# Altium schematic sheet FLS Start_A Distribution.SchDoc
size 558 x 401 mm; Organization: Carnegie Institution of Washington; SheetNumber: 0; SheetTotal: 0; PageSetup: Record=PageOptions|CenterHorizontal=True|CenterVertical=True|PrintScale=0.47|XCorrection=1.00|YCorrection=1.00|PrintKind=0|BorderSize=5000000|LeftOffset=0|BottomOffset=0|Orientation=2|PaperLength=1000|PaperWidth=1000|Scale=100|PaperSource=259|PrintQuality=600|MediaType=1|DitherType=10|PaperKind=Letter (8.5 x 11")|PrintScaleMode=1
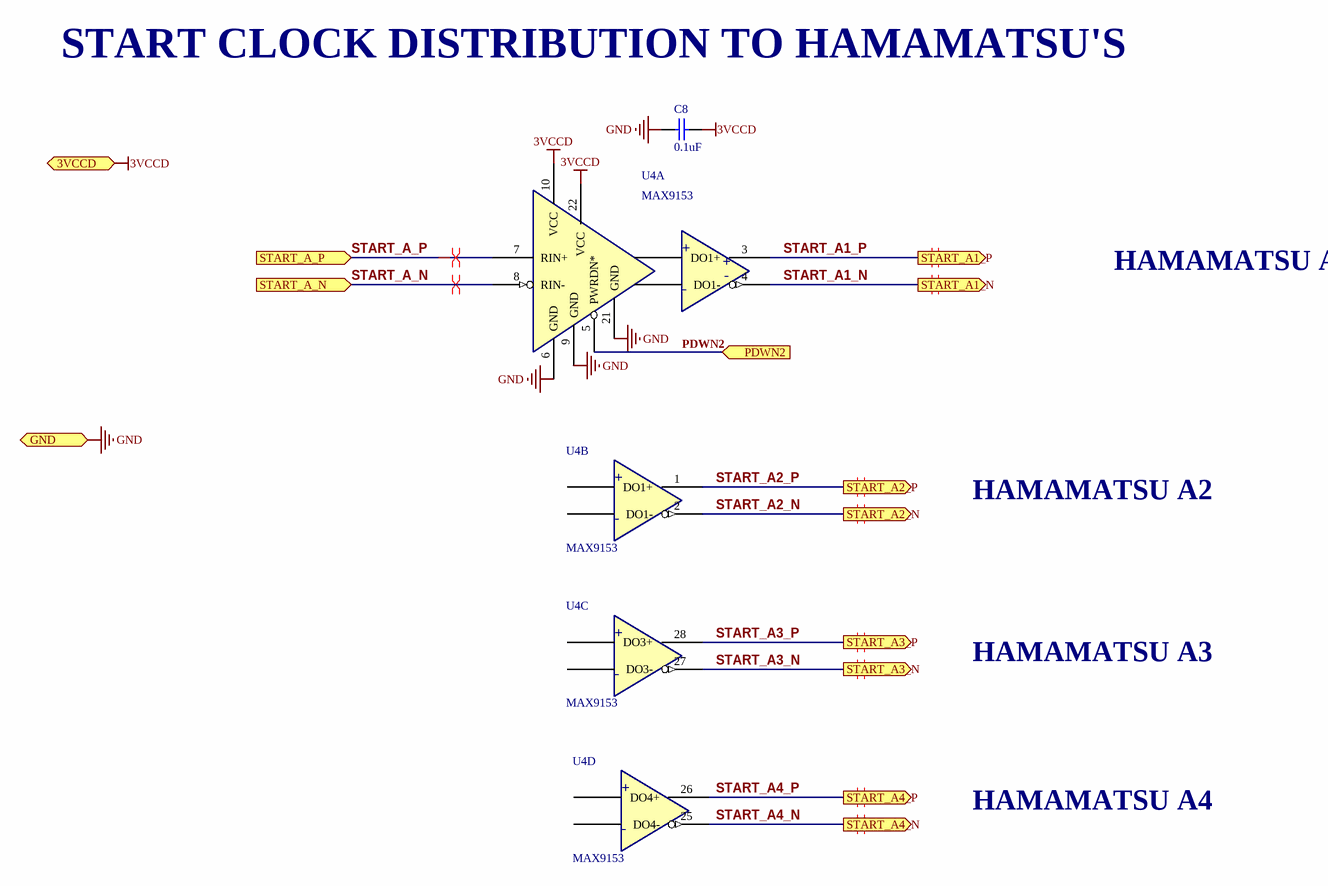
[diagram p0: FLS Start_A Distribution.SchDoc]

## Parts
C8  0.1uF  [0805 slim]
U4  MAX9153  [MAX9153EUI]  (parts A,B,C,D of 10)

## Ports
3VCCD (in), GND (in), PDWN2 (in), START_A1_N (out), START_A1_P (out), START_A2_N (out), START_A2_P (out), START_A3_N (out), START_A3_P (out), START_A4_N (out), START_A4_P (out), START_A_N (in), START_A_P (in)

## Nets
3VCCD: C8.2 U4.10(VCC) U4.22(VCC) ; port 3VCCD
GND: C8.1 U4.6(GND) U4.9(GND) U4.21(GND) ; port GND
PDWN2: U4.5(PWRDN*) ; port PDWN2
START_A1_N: U4.4(DO1-) ; port START_A1_N
START_A1_P: U4.3(DO1+) ; port START_A1_P
START_A2_N: U4.2(DO1-) ; port START_A2_N
START_A2_P: U4.1(DO1+) ; port START_A2_P
START_A3_N: U4.27(DO3-) ; port START_A3_N
START_A3_P: U4.28(DO3+) ; port START_A3_P
START_A4_N: U4.25(DO4-) ; port START_A4_N
START_A4_P: U4.26(DO4+) ; port START_A4_P
START_A_N: U4.8(RIN-) ; port START_A_N
START_A_P: U4.7(RIN+) ; port START_A_P

## Layout directives
differential pair: START_A1_N, START_A1_P, START_A2_N, START_A2_P, START_A3_N, START_A3_P, START_A4_N, START_A4_P, START_A_N, START_A_P

## Notes on the sheet
- START CLOCK DISTRIBUTION TO HAMAMATSU'S
- HAMAMATSU A1
- HAMAMATSU A2
- HAMAMATSU A3
- HAMAMATSU A4
- Carnegie Institution of Washington
- 813 Santa Barbara Street
- The Observatories
- PHONE (626) 577-1122               FAX (626) 795-8136
- Pasadena, California 91101
- Title:
- OCIW
- Size:
- Date:
- C
- Scale:
- Drawn By:
- Checked By:
- A. BAGISH
- alanb
- Revision:
- Sheet          of
- File:
- (in symbol MAX9153, part A) +; -
- (in symbol MAX9153, part B) +; -
- (in symbol MAX9153, part C) +; -
- (in symbol MAX9153, part D) +; -

## Library data of the parts
C8 = Cap: Capacitor; Murata Electronics North America: GRM216F51E104ZA01D; Published: 8-Jun-2000; LatestRevisionDate: 17-Jul-2002; LatestRevisionNote: Re-released for DXP Platform.; PackageReference: RAD-0.3; Publisher: Altium Limited; Value: 0.1uF; Digi-Key: 490-1726-2-ND; Footprint: 0805